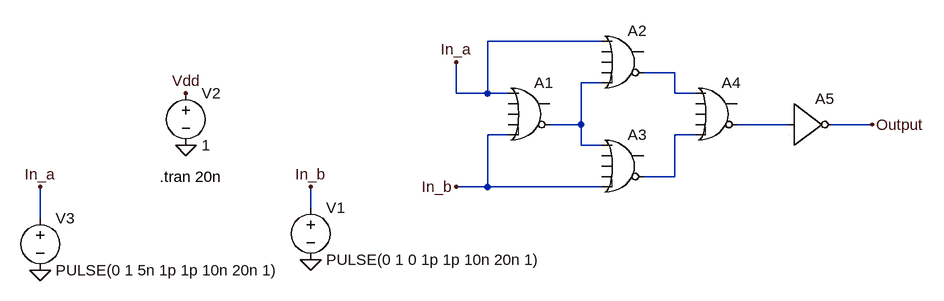
[diagram p0: schematic 1e.asc]
1e.asc, the LTspice schematic file:
Version 4
SHEET 1 1508 680
WIRE 592 -144 416 -144
WIRE 704 -96 656 -96
WIRE 592 -80 560 -80
WIRE 368 -64 368 -112
WIRE 416 -64 416 -144
WIRE 416 -64 368 -64
WIRE 448 -64 416 -64
WIRE 704 -64 704 -96
WIRE 736 -64 704 -64
WIRE 560 -16 560 -80
WIRE 560 -16 512 -16
WIRE 880 -16 800 -16
WIRE 1008 -16 944 -16
WIRE 448 0 416 0
WIRE 736 0 704 0
WIRE 560 16 560 -16
WIRE 592 16 560 16
WIRE 704 64 704 0
WIRE 704 64 656 64
WIRE 416 80 416 0
WIRE 416 80 368 80
WIRE 592 80 416 80
WIRE 144 112 144 80
WIRE -272 128 -272 80
FLAG 144 192 0
FLAG 1008 -16 Output
FLAG -48 16 0
FLAG -48 -64 Vdd
FLAG 368 80 In_b
FLAG 368 -112 In_a
FLAG -272 208 0
FLAG -272 80 In_a
FLAG 144 80 In_b
SYMBOL voltage 144 96 R0
WINDOW 123 0 0 Left 0
WINDOW 39 0 0 Left 0
SYMATTR InstName V1
SYMATTR Value PULSE(0 1 0 1p 1p 10n 20n 1)
SYMBOL voltage -48 -80 R0
WINDOW 123 0 0 Left 0
WINDOW 39 0 0 Left 0
SYMATTR InstName V2
SYMATTR Value 1
SYMBOL voltage -272 112 R0
WINDOW 123 0 0 Left 0
WINDOW 39 0 0 Left 0
SYMATTR InstName V3
SYMATTR Value PULSE(0 1 5n 1p 1p 10n 20n 1)
SYMBOL Digital\\or 480 -96 R0
SYMATTR InstName A1
SYMBOL Digital\\or 624 -176 R0
SYMATTR InstName A2
SYMBOL Digital\\or 624 -16 R0
SYMATTR InstName A3
SYMBOL Digital\\or 768 -96 R0
SYMATTR InstName A4
SYMBOL Digital\\inv 880 -80 R0
SYMATTR InstName A5
TEXT -88 64 Left 2 !.tran 20n

The netlist it stands for:
* 1e.asc
V1 In_b 0 PULSE(0 1 0 1p 1p 10n 20n 1)
V2 Vdd 0 1
V3 In_a 0 PULSE(0 1 5n 1p 1p 10n 20n 1)
A1 In_a 0 0 0 In_b N002 0 0 OR
A2 In_a 0 0 0 N002 N001 0 0 OR
A3 N002 0 0 0 In_b N004 0 0 OR
A4 N001 0 0 0 N004 N003 0 0 OR
A5 N003 0 0 0 0 Output 0 0 BUF
.tran 20n
.backanno
.end